# Altium schematic sheet Schematic.SchDoc
size A4; SheetNumber: 1; SheetTotal: 1
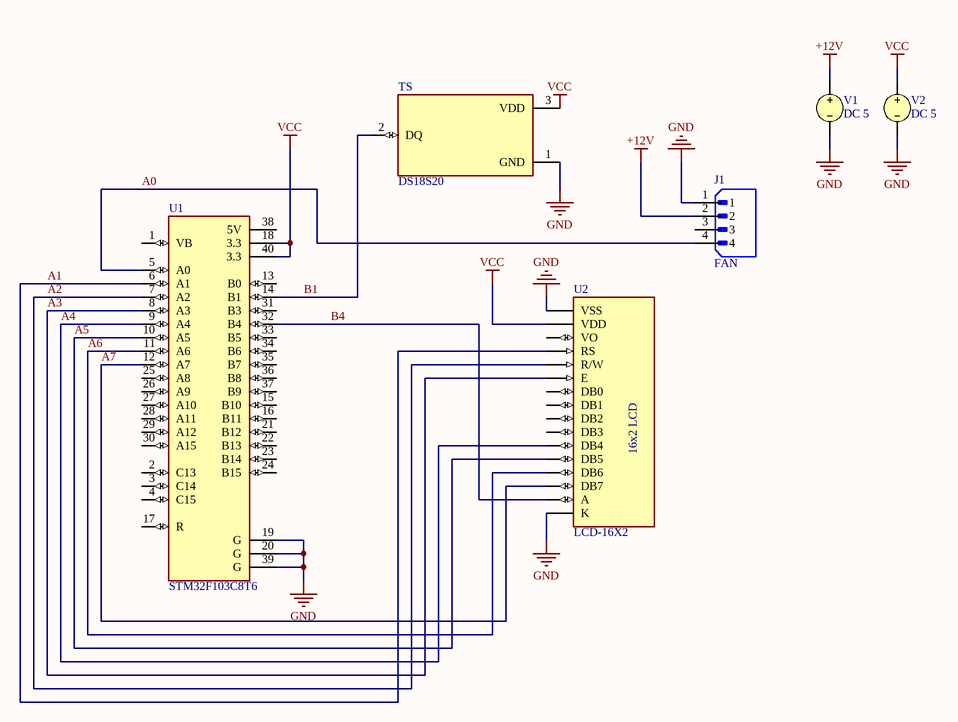
[diagram p0: Schematic.SchDoc]

## Parts
J1  FAN  [JST_B4B-XH-A(LF)(SN)]
TS  DS18S20  [TO92127P495H695-3]
U1  STM32F103C8T6  [MODULE_ZC323000]
U2  LCD-16X2  [MODULE_LCD-16X2]
V1  DC 5
V2  DC 5

## Nets
+12V: J1.2 V1.1
GND: J1.1 TS.1(GND) U1.19(G) U1.20(G) U1.39(G) U2.1(VSS) U2.16(K) V1.2 V2.2
VCC: TS.3(VDD) U1.18(3.3) U1.40(3.3) U2.2(VDD) V2.1
A0: J1.4 U1.5(A0)
A1: U1.6(A1) U2.4(RS)
A2: U1.7(A2) U2.5(R/W)
A3: U1.8(A3) U2.6(E)
A4: U1.9(A4) U2.11(DB4)
A5: U1.10(A5) U2.12(DB5)
A6: U1.11(A6) U2.13(DB6)
A7: U1.12(A7) U2.14(DB7)
B1: TS.2(DQ) U1.14(B1)
B4: U1.32(B4) U2.15(A)

Not connected (* = marked no-connect by the designer): J1 3; U1 1(VB) 2(C13) 3(C14) 4(C15) 13(B0) 15(B10) 16(B11) 17(R) 21(B12) 22(B13) 23(B14) 24(B15) 25(A8) 26(A9) 27(A10) 28(A11) 29(A12) 30(A15) 31(B3) 33(B5) 34(B6) 35(B7) 36(B8) 37(B9) 38(5V); U2 3(VO) 7(DB0) 8(DB1) 9(DB2) 10(DB3)

## Notes on the sheet
- (in symbol LCD-16X2) 16x2 LCD

## Library data of the parts
J1 = B4B-XH-A(LF)(SN): Connector Header Through Hole 4 position 0.098 (2.50mm); MF: JST Sales; SnapEDA_Link: https://www.snapeda.com/parts/B4B-XH-A(LF)(SN)/JST+Sales+America+Inc./view-part/?ref=snap; Package: None; Value: *; MP: B4B-XH-A(LF)(SN); Check_prices: https://www.snapeda.com/parts/B4B-XH-A(LF)(SN)/JST+Sales+America+Inc./view-part/?ref=eda
TS = DS18S20+: Temperature Sensor Digital, Local -55Â°C ~ 125Â°C 9 b TO-92-3; MF: Maxim Integrated; Value: *; SnapEDA_Link: https://www.snapeda.com/parts/DS18S20/Maxim%20Integrated/view-part/2763308/?ref=snap; Availability: Warning; Price: None; Package: TO-92 Maxim Integrated; DigiKey-Purchase-URL: https://snapeda.com/shop?store=DigiKey&id=2763308; MP: DS18S20
U1 = ZC323000: STM32F103C8T6 ARM STM32 Minimum System Development Board Module For Arduino; Package: None; MP: ZC323000; Value: *; Availability: Unavailable; Price: None
U2 = LCD-16X2: Display Development Tools 16x2 Black on Green Char LCD w Backlight; MF: Gravitech; SnapEDA_Link: https://www.snapeda.com/parts/LCD-16X2/Gravitech/view-part/?ref=snap; Package: None; Value: *; MP: LCD-16X2; Check_prices: https://www.snapeda.com/parts/LCD-16X2/Gravitech/view-part/?ref=eda
V1 V2 = VSRC: Voltage Source; Note: PCB Footprint - Not required; AC Magnitude: 1; AC Phase: 0; Value: 5; Published: 8-Jun-2000; LatestRevisionDate: 17-Jul-2002; LatestRevisionNote: Re-released for DXP Platform.; PackageReference: Not Applicable; Publisher: Altium Limited